# EasyEDA Pro project Car_2026-06-29.epro

# Schematic Schematic1
Board Name: Board1; Create Date: 2026-05-23; Page Name: P1; Project Name: 26电赛-校赛-两驱-1.2; Schematic Name: Schematic1; Update Date: 2026-06-12; Company: 嘉立创EDA; Page Size: A4; Version: V1.0
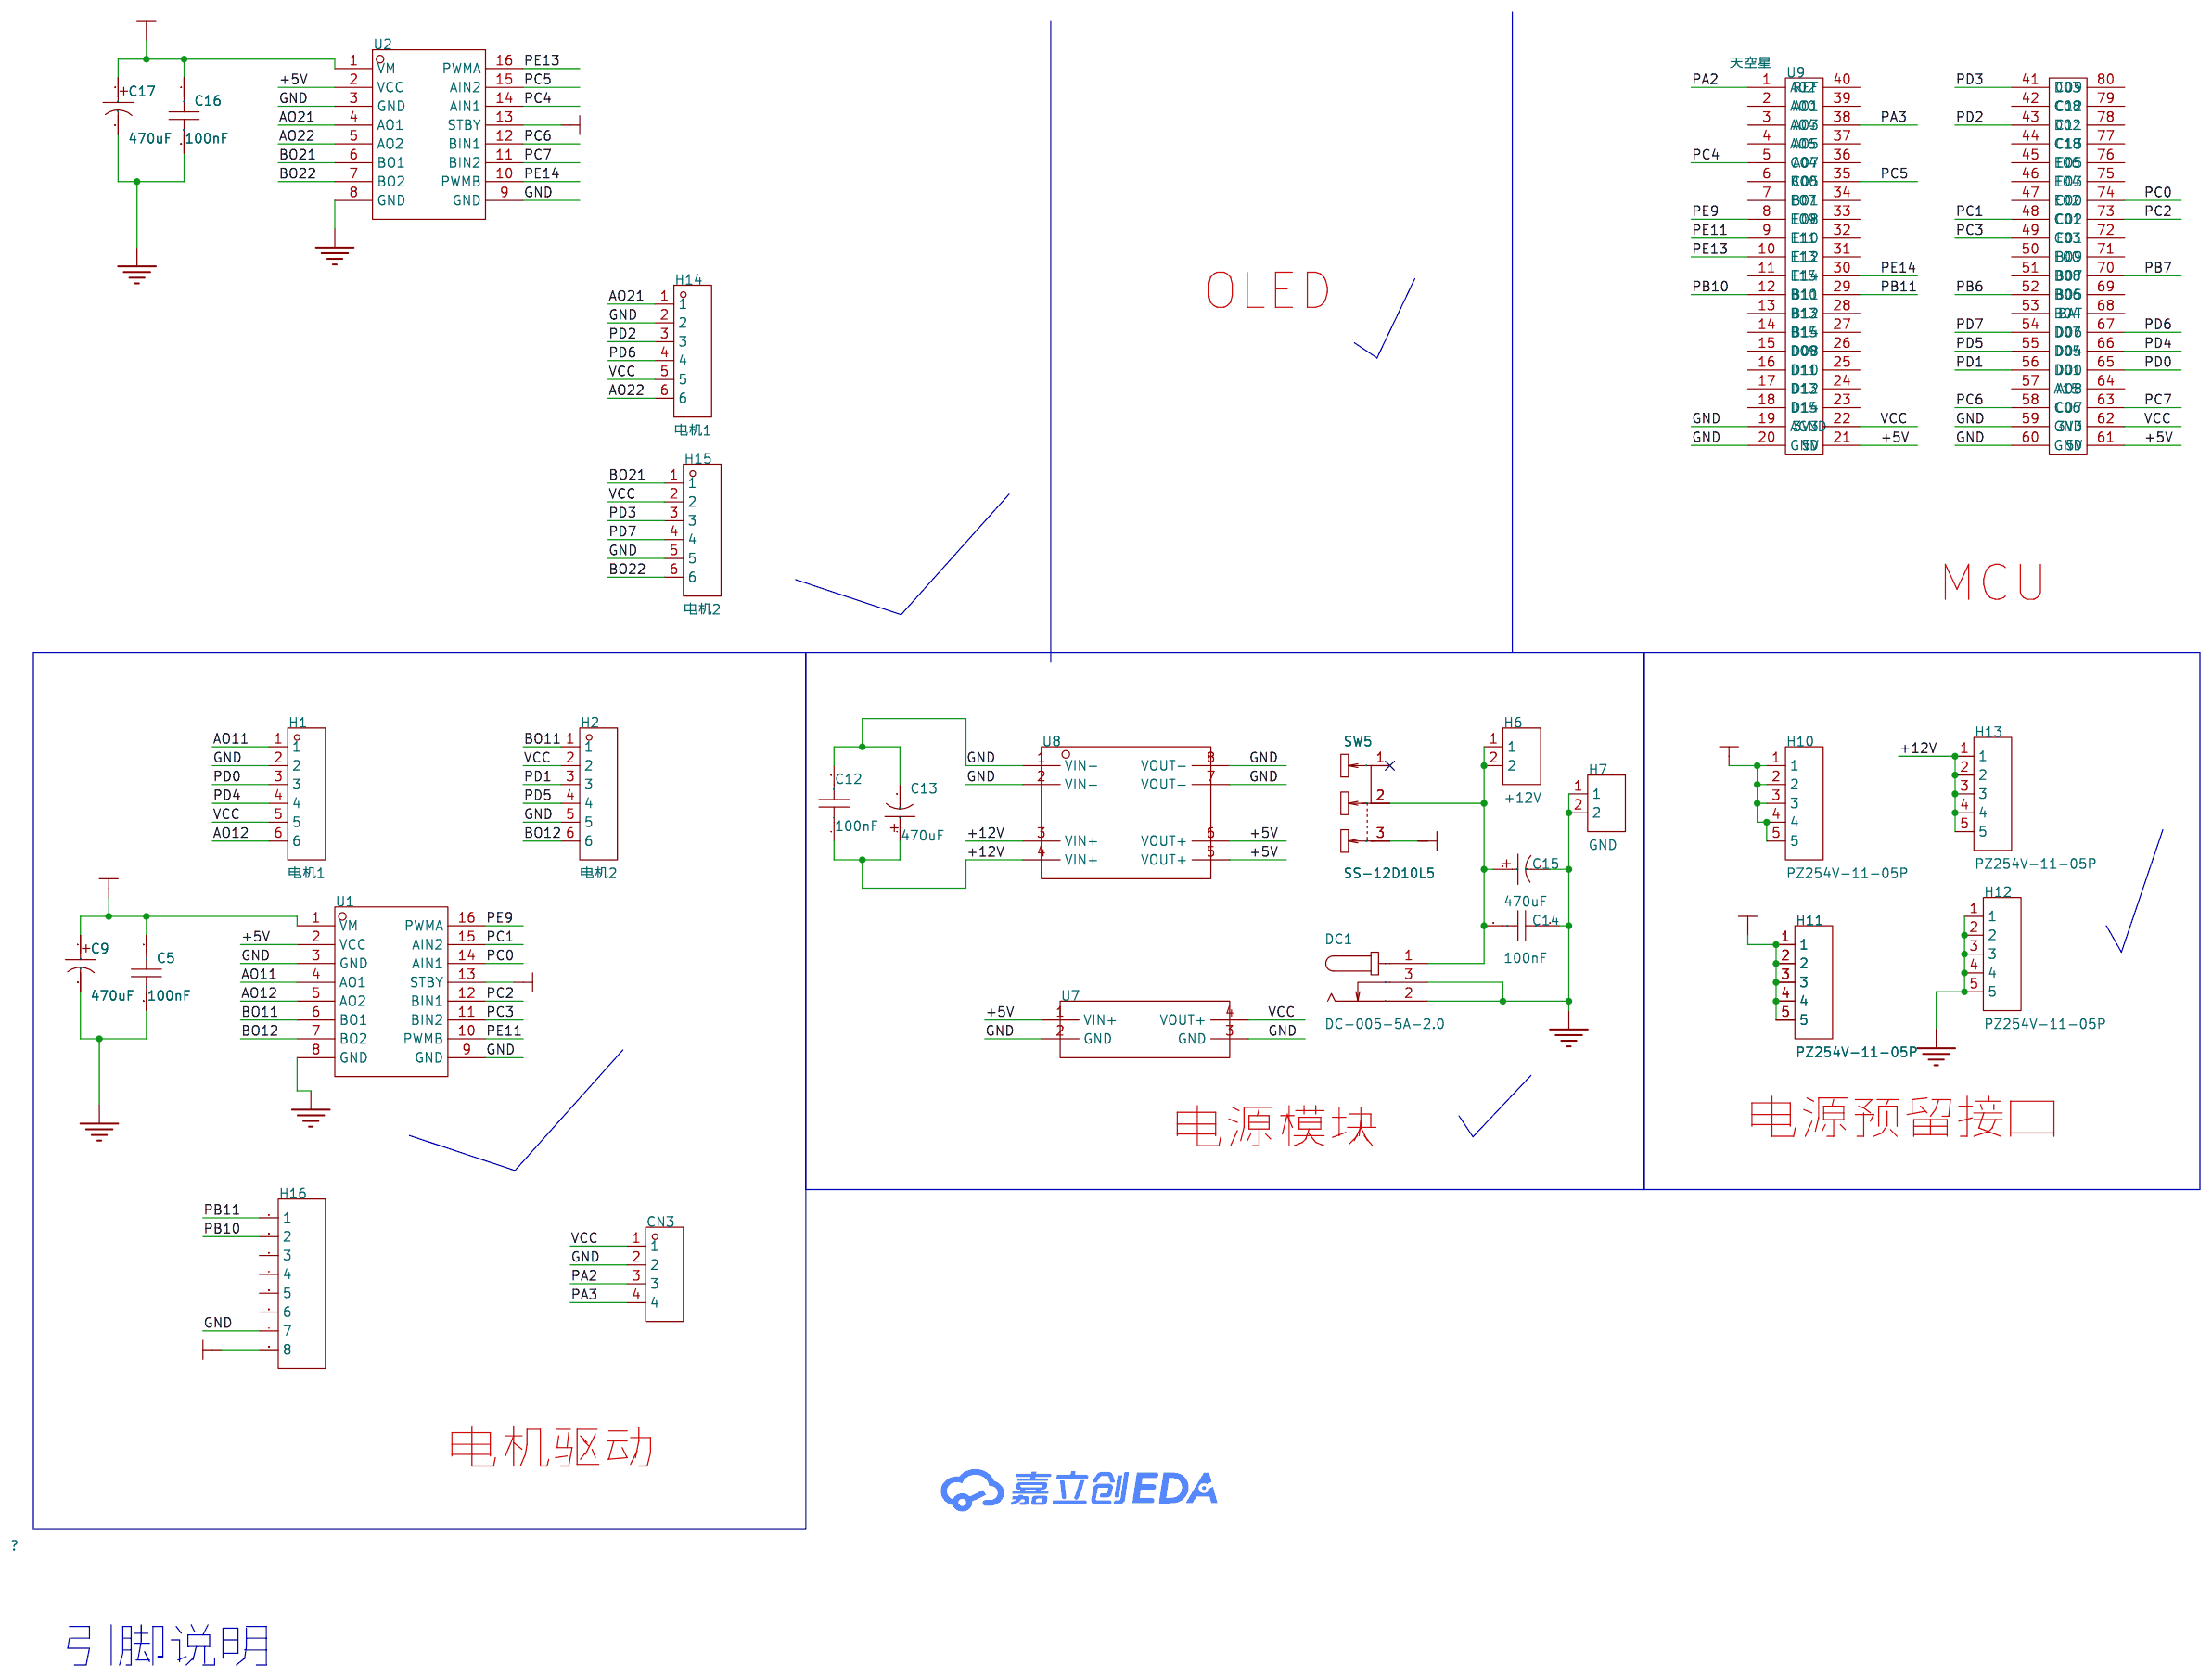
[diagram p0: schematic sheet]

## Parts
C5  100nF  [CAP-TH_L5.0-W2.5-P5.00-D1.0]
C9  470uF  [CAP-TH_BD10.0-P5.00-D1.0-FD]
C12  100nF  [CAP-TH_L5.0-W2.5-P5.00-D1.0]
C13  470uF  [CAP-TH_BD10.0-P5.00-D1.0-FD]
C14  100nF  [CAP-TH_L5.0-W2.5-P5.00-D1.0]
C15  470uF  [CAP-TH_BD10.0-P5.00-D1.0-FD]
C16  100nF  [CAP-TH_L5.0-W2.5-P5.00-D1.0]
C17  470uF  [CAP-TH_BD10.0-P5.00-D1.0-FD]
CN3  视觉  [CONN-TH_4P-P2.50_4PIN]
DC1  DC-005-5A-2.0  [DC-IN-TH_DC-005-5A-2.0]
H1  电机1  [HDR-TH_6P-P2.54-V-F]
H2  电机2  [HDR-TH_6P-P2.54-V-F]
H6  +12V  [HDR-TH_2P-P2.54-V-M]
H7  GND  [HDR-TH_2P-P2.54-V-M]
H10  PZ254V-11-05P  [HDR-TH_5P-P2.54-V-M]
H11  PZ254V-11-05P  [HDR-TH_5P-P2.54-V-M]
H12  PZ254V-11-05P  [HDR-TH_5P-P2.54-V-M]
H13  PZ254V-11-05P  [HDR-TH_5P-P2.54-V-M]
H14  电机1  [HDR-TH_6P-P2.54-V-F]
H15  电机2  [HDR-TH_6P-P2.54-V-F]
H16  -  [HDR-TH_8P-P2.54-V-M]
SW5  SS-12D10L5  [SW-TH_SS-12D10L5]
U1  TB6612  [TB6612]
U2  TB6612  [TB6612]
U7  AMS1117  [AMS1117]
U8  MP1584  [MP1584]
U9  天空星  [天空星]

## Library data of the parts
C5 C12 C14 C16 = CC1H104MC1FD3F6C10MF: 容值:100nF;精度:±20%;额定电压:50V;温度系数:Y5V;; LCSC Part Name: 100nF ±20% 50V; Supplier Part: C254085; Manufacturer: Dersonic(德尔创); Supplier Footprint: 插件,P=5.08mm; JLCPCB Part Class: 扩展库; Datasheet: https://atta.szlcsc.com/upload/public/pdf/source/20200826/C254085_159DD65BF32BF11C9168D341BCE23E6F.pdf; Supplier: LCSC; Tolerance: ±20%; Voltage Rating: 50V; Pin Spacing: 5.08mm; Temperature Coefficient: Y5V; Diameter: 6mm; Body Thickness: 2.2mm
C9 C13 C15 C17 = ERS1VM471G16OT: 容值:470uF;精度:±20%;额定电压:35V;; LCSC Part Name: 470uF ±20% 35V; Supplier Part: C106703; Manufacturer: AISHI(艾华集团); Supplier Footprint: 插件,D10xL16mm; JLCPCB Part Class: 扩展库; Datasheet: https://atta.szlcsc.com/upload/public/pdf/source/20191015/C438940_4B8E60A742BB0AE40DDEF87A5C89089D.pdf; Supplier: LCSC; Tolerance: ±20%; Voltage Rating: 35V; Pin Spacing: 5mm; Diameter: 10mm; Height - Seated (Max): 16mm; Lifetime: 7000hrs@105℃
CN3 = ZX-XH2.54-4PZZ: 插针结构:1x4P;间距:2.5mm;安装方式:直插;参考系列:XH;总PIN数:4P;排数:1;每排PIN数:4;行距:-;额定电流:3A;触头材质:黄铜;触头镀层:锡;工作温度范围:-25℃~+85℃;; LCSC Part Name: 1x4P 间距:2.5mm 直插 系列:XH; Supplier Part: C7429634; Manufacturer: Megastar(兆星); Supplier Footprint: 插件,P=2.5mm; JLCPCB Part Class: 扩展库; Datasheet: https://atta.szlcsc.com/upload/public/pdf/source/20230619/B529A2163E0159A644AB3383D208FB03.pdf; Supplier: LCSC; Pins Structure: 1x4P; Pitch: 2.5mm; Mounting Type: 直插; Reference Series: XH; Number of Pins: 4P; Number of Rows: 1; Number of PINs Per Row: 4; Rated Current: 3A; Contact Material: 黄铜; Contact Plating: 锡; Operating Temperature: -25℃~+85℃; Rated Voltage (Max): 250V; Plastic Material: PA66; Flame Retardant Rating: UL94V-0; Color: 白色; Z-Height of the Board: 7mm; X-Length of Bottom Edge on Board (Spacing Line): 12.5mm; Y-Width of Bottom Edge on Board: 5.9mm
DC1 = DC-005-5A-2.0: 连接器类型:DC电源插座;安装方式:弯插;触点内径:2mm;触点外径:6.2mm;额定电流:5A;额定电压:24V;工作温度范围:-20℃~+70℃;; LCSC Part Name: DC电源插座 内径:2mm 外径:6.2mm; Supplier Part: C381116; Manufacturer: XKB Connection(中国星坤); Supplier Footprint: 插件; JLCPCB Part Class: 扩展库; Datasheet: https://atta.szlcsc.com/upload/public/pdf/source/20211015/707A35F7AB6E89C57AAB641950105BB7.pdf; Supplier: LCSC; Connector Type: DC电源插座; Mounting Style: 弯插; Inside Contact Diameter: 2mm; Outside Contact Diameter: 6.2mm; Current Rating (Max): 5A; Voltage Rating (Max): 24V; Operating Temperature Range: -20℃~+70℃
H1 H2 H14 H15 = PM254V-11-06-H85: 插孔结构:1x6P;间距:2.54mm;行距:-;圆孔/方孔:方孔;安装类型:直插;排数:单排;总孔位数:6P;额定电流:3A;额定电压:250V;插孔方向:顶部;塑高:-;工作温度范围:-40℃~+105℃;; LCSC Part Name: 间距:2.54mm 1x6P 直插; Supplier Part: C2832269; Manufacturer: XFCN(兴飞); Supplier Footprint: 插件,P=2.54mm; JLCPCB Part Class: 扩展库; Datasheet: https://atta.szlcsc.com/upload/public/pdf/source/20210514/C2832269_B3EC97736B37C2783BDCE3050AA57447.pdf; Supplier: LCSC; Holes Structure: 1x6P; Pitch: 2.54mm; Circular Hole / Square Hole: 方孔; Mounting Type: 直插; Number of Rows: 单排; Number of Holes: 6P; Current Rating (Max): 3A; Voltage Rating (Max): 250V; Holes Direction: 顶部; Operating Temperature Range: -40℃~+105℃
H6 H7 = PZ254V-11-02P: 插针结构:1x2P;间距:2.54mm;行距:-;圆针/方针:方针;安装方式:直插;排数:单排;总PIN位数:2P;额定电流:-;额定电压:-;配合针长度:6mm;塑高:2.5mm;端接针长度:3mm;触头材质:黄铜;触头镀层:-;工作温度:-40℃~+105℃;颜色:黑色;; LCSC Part Name: 1x2P 间距:2.54mm 方针 直插; Supplier Part: C492401; Manufacturer: XFCN(兴飞); Supplier Footprint: 插件,P=2.54mm; JLCPCB Part Class: 扩展库; Datasheet: https://item.szlcsc.com/datasheet/PZ254V-11-02P/502957.html; Supplier: LCSC; Pin Structure: 1x2P; Pitch: 2.54mm; Circluar Pins/Square Pins: 方针; Mounting Type: 直插; Number of Rows: 单排; Number of Pins: 2P; Length of Mating Pin: 6mm; Insulation Height: 2.5mm; Length of End Connection Pin: 3mm; Contact Material: 黄铜; Operating Temperature: -40℃~+105℃; Color: 黑色
H10-H13 = PZ254V-11-05P: 插针结构:1x5P;间距:2.54mm;行距:-;圆针/方针:方针;安装方式:直插;排数:单排;总PIN位数:5P;额定电流:3A;额定电压:250V;配合针长度:6mm;塑高:2.5mm;端接针长度:3mm;触头材质:黄铜;触头镀层:-;工作温度:-40℃~+105℃;颜色:黑色;; LCSC Part Name: 1x5P 间距:2.54mm 方针 直插; Supplier Part: C492404; Manufacturer: XFCN(兴飞); Supplier Footprint: 插件,P=2.54mm; JLCPCB Part Class: 扩展库; Datasheet: https://item.szlcsc.com/datasheet/PZ254V-11-05P/502960.html; Supplier: LCSC; Pin Structure: 1x5P; Pitch: 2.54mm; Circluar Pins/Square Pins: 方针; Mounting Type: 直插; Number of Rows: 单排; Number of Pins: 5P; Current Rating: 3A; Voltage Rating (Max): 250V; Length of Mating Pin: 6mm; Insulation Height: 2.5mm; Length of End Connection Pin: 3mm; Contact Material: 黄铜; Operating Temperature: -40℃~+105℃; Color: 黑色
H16 = HDR-M_2.54_1x8P: Supplier Part: C124381; Supplier Footprint: 插件
SW5 = SS-12D10L5: 电路结构:单刀双掷;安装方式:直插;开关颜色:黑色;额定电流(DC):3A;额定电压(DC):125V;额定电流(AC):3A;额定电压(AC):125V;机械寿命:1万次;; LCSC Part Name: 柄长5mm 直插双档 滑动开关; Supplier Part: C319012; Manufacturer: XKB Connectivity(中国星坤); Supplier Footprint: 插件; JLCPCB Part Class: 扩展库; Datasheet: https://atta.szlcsc.com/upload/public/pdf/source/20211009/D6412F37AABE6F9459A6EE7FA4DAEADB.pdf; Supplier: LCSC; Circuit: 单刀双掷; Actuator Style: 矩形柱状; Pin Style: PC引脚; Switch Length: 13mm; Switch Width: 6.8mm; Switch Height: 6.4mm; Mounting Style: 直插; Actuator Color: 黑色; Current Rating (DC): 3A; Voltage Rating (DC): 125V; Current Rating (AC): 3A; Voltage Rating (AC): 125V; Mechanical Life: 1万次; Operating Temperature: -40℃~+85℃
U1 U2 = TB6612: 市场上的TB6612模块，红色那款
U7 = AMS1117: AMS1117稳压管，5V转3.3V
U8 = MP1584: MP1584EN DC-DC可调降压模块，绿色小板
U9 = 天空星

## Nets
+5V: H11.1 H11.2 H11.3 H11.4 H11.5 U1.2(VCC) U1.13(STBY) U2.2(VCC) U2.13(STBY) U7.1(VIN+) U8.5(VOUT+) U8.6(VOUT+) U9.21(5V) U9.61(5V)
+12V: C5.1 C9.1 C12.1 C13.1 C16.1 C17.1 H13.1 H13.2 H13.3 H13.4 H13.5 H16.8 SW5.3 U1.1(VM) U2.1(VM) U8.3(VIN+) U8.4(VIN+)
GND: C5.2 C9.2 C12.2 C13.2 C14.1 C15.2 C16.2 C17.2 CN3.2 DC1.2 DC1.3 H1.2 H2.5 H7.1 H7.2 H12.1 H12.2 H12.3 H12.4 H12.5 H14.2 H15.5 H16.7 U1.3(GND) U1.8(GND) U1.9(GND) U2.3(GND) U2.8(GND) U2.9(GND) U7.2(GND) U7.3(GND) U8.1(VIN-) U8.2(VIN-) U8.7(VOUT-) U8.8(VOUT-) U9.19(AGND) U9.20(GND) U9.59(GND) U9.60(GND)
VCC: CN3.1 H1.5 H2.2 H10.1 H10.2 H10.3 H10.4 H10.5 H14.5 H15.2 U7.4(VOUT+) U9.22(3V3) U9.62(3V3)
AO11: H1.1 U1.4(AO1)
AO12: H1.6 U1.5(AO2)
AO21: H14.1 U2.4(AO1)
AO22: H14.6 U2.5(AO2)
BO11: H2.1 U1.6(BO1)
BO12: H2.6 U1.7(BO2)
BO21: H15.1 U2.6(BO1)
BO22: H15.6 U2.7(BO2)
PA2: CN3.3 U9.1(A02)
PA3: CN3.4 U9.38(A03)
PB6: U9.52(B06)
PB7: U9.70(B07)
PB10: H16.2 U9.12(B10)
PB11: H16.1 U9.29(B11)
PC0: U1.14(AIN1) U9.74(C00)
PC1: U1.15(AIN2) U9.48(C01)
PC2: U1.12(BIN1) U9.73(C02)
PC3: U1.11(BIN2) U9.49(C03)
PC4: U2.14(AIN1) U9.5(C04)
PC5: U2.15(AIN2) U9.35(C05)
PC6: U2.12(BIN1) U9.58(C06)
PC7: U2.11(BIN2) U9.63(C07)
PD0: H1.3 U9.65(D00)
PD1: H2.3 U9.56(D01)
PD2: H14.3 U9.43(D02)
PD3: H15.3 U9.41(D03)
PD4: H1.4 U9.66(D04)
PD5: H2.4 U9.55(D05)
PD6: H14.4 U9.67(D06)
PD7: H15.4 U9.54(D07)
PE9: U1.16(PWMA) U9.8(E09)
PE11: U1.10(PWMB) U9.9(E11)
PE13: U2.16(PWMA) U9.10(E13)
PE14: U2.10(PWMB) U9.30(E14)
$1N2072: C14.2 C15.1 DC1.1 H6.1 H6.2 SW5.2

Not connected (* = marked no-connect by the designer): H16 3 4 5 6; SW5 1*; U9 2(A00) 3(A04) 4(A06) 6(B00) 7(E07) 11(E15) 13(B13) 14(B15) 15(D09) 16(D11) 17(D13) 18(D15) 23(D14) 24(D12) 25(D10) 26(D08) 27(B14) 28(B12) 31(E12) 32(E10) 33(E08) 34(B01) 36(A07) 37(A05) 39(A01) 40(REF) 42(C08) 44(C18) 45(E06) 46(E04) 47(E02) 50(E00) 51(B08) 53(B04) 57(A15) 64(A08) 68(BAT) 69(B05) 71(B09) 72(E01) 75(E03) 76(E05) 77(C13) 78(C11) 79(C12) 80(C09)

## Notes on the sheet
- OLED
- MCU
- 电源模块
- 电源预留接口
- 电机驱动
- 引脚说明

# Board PCB1
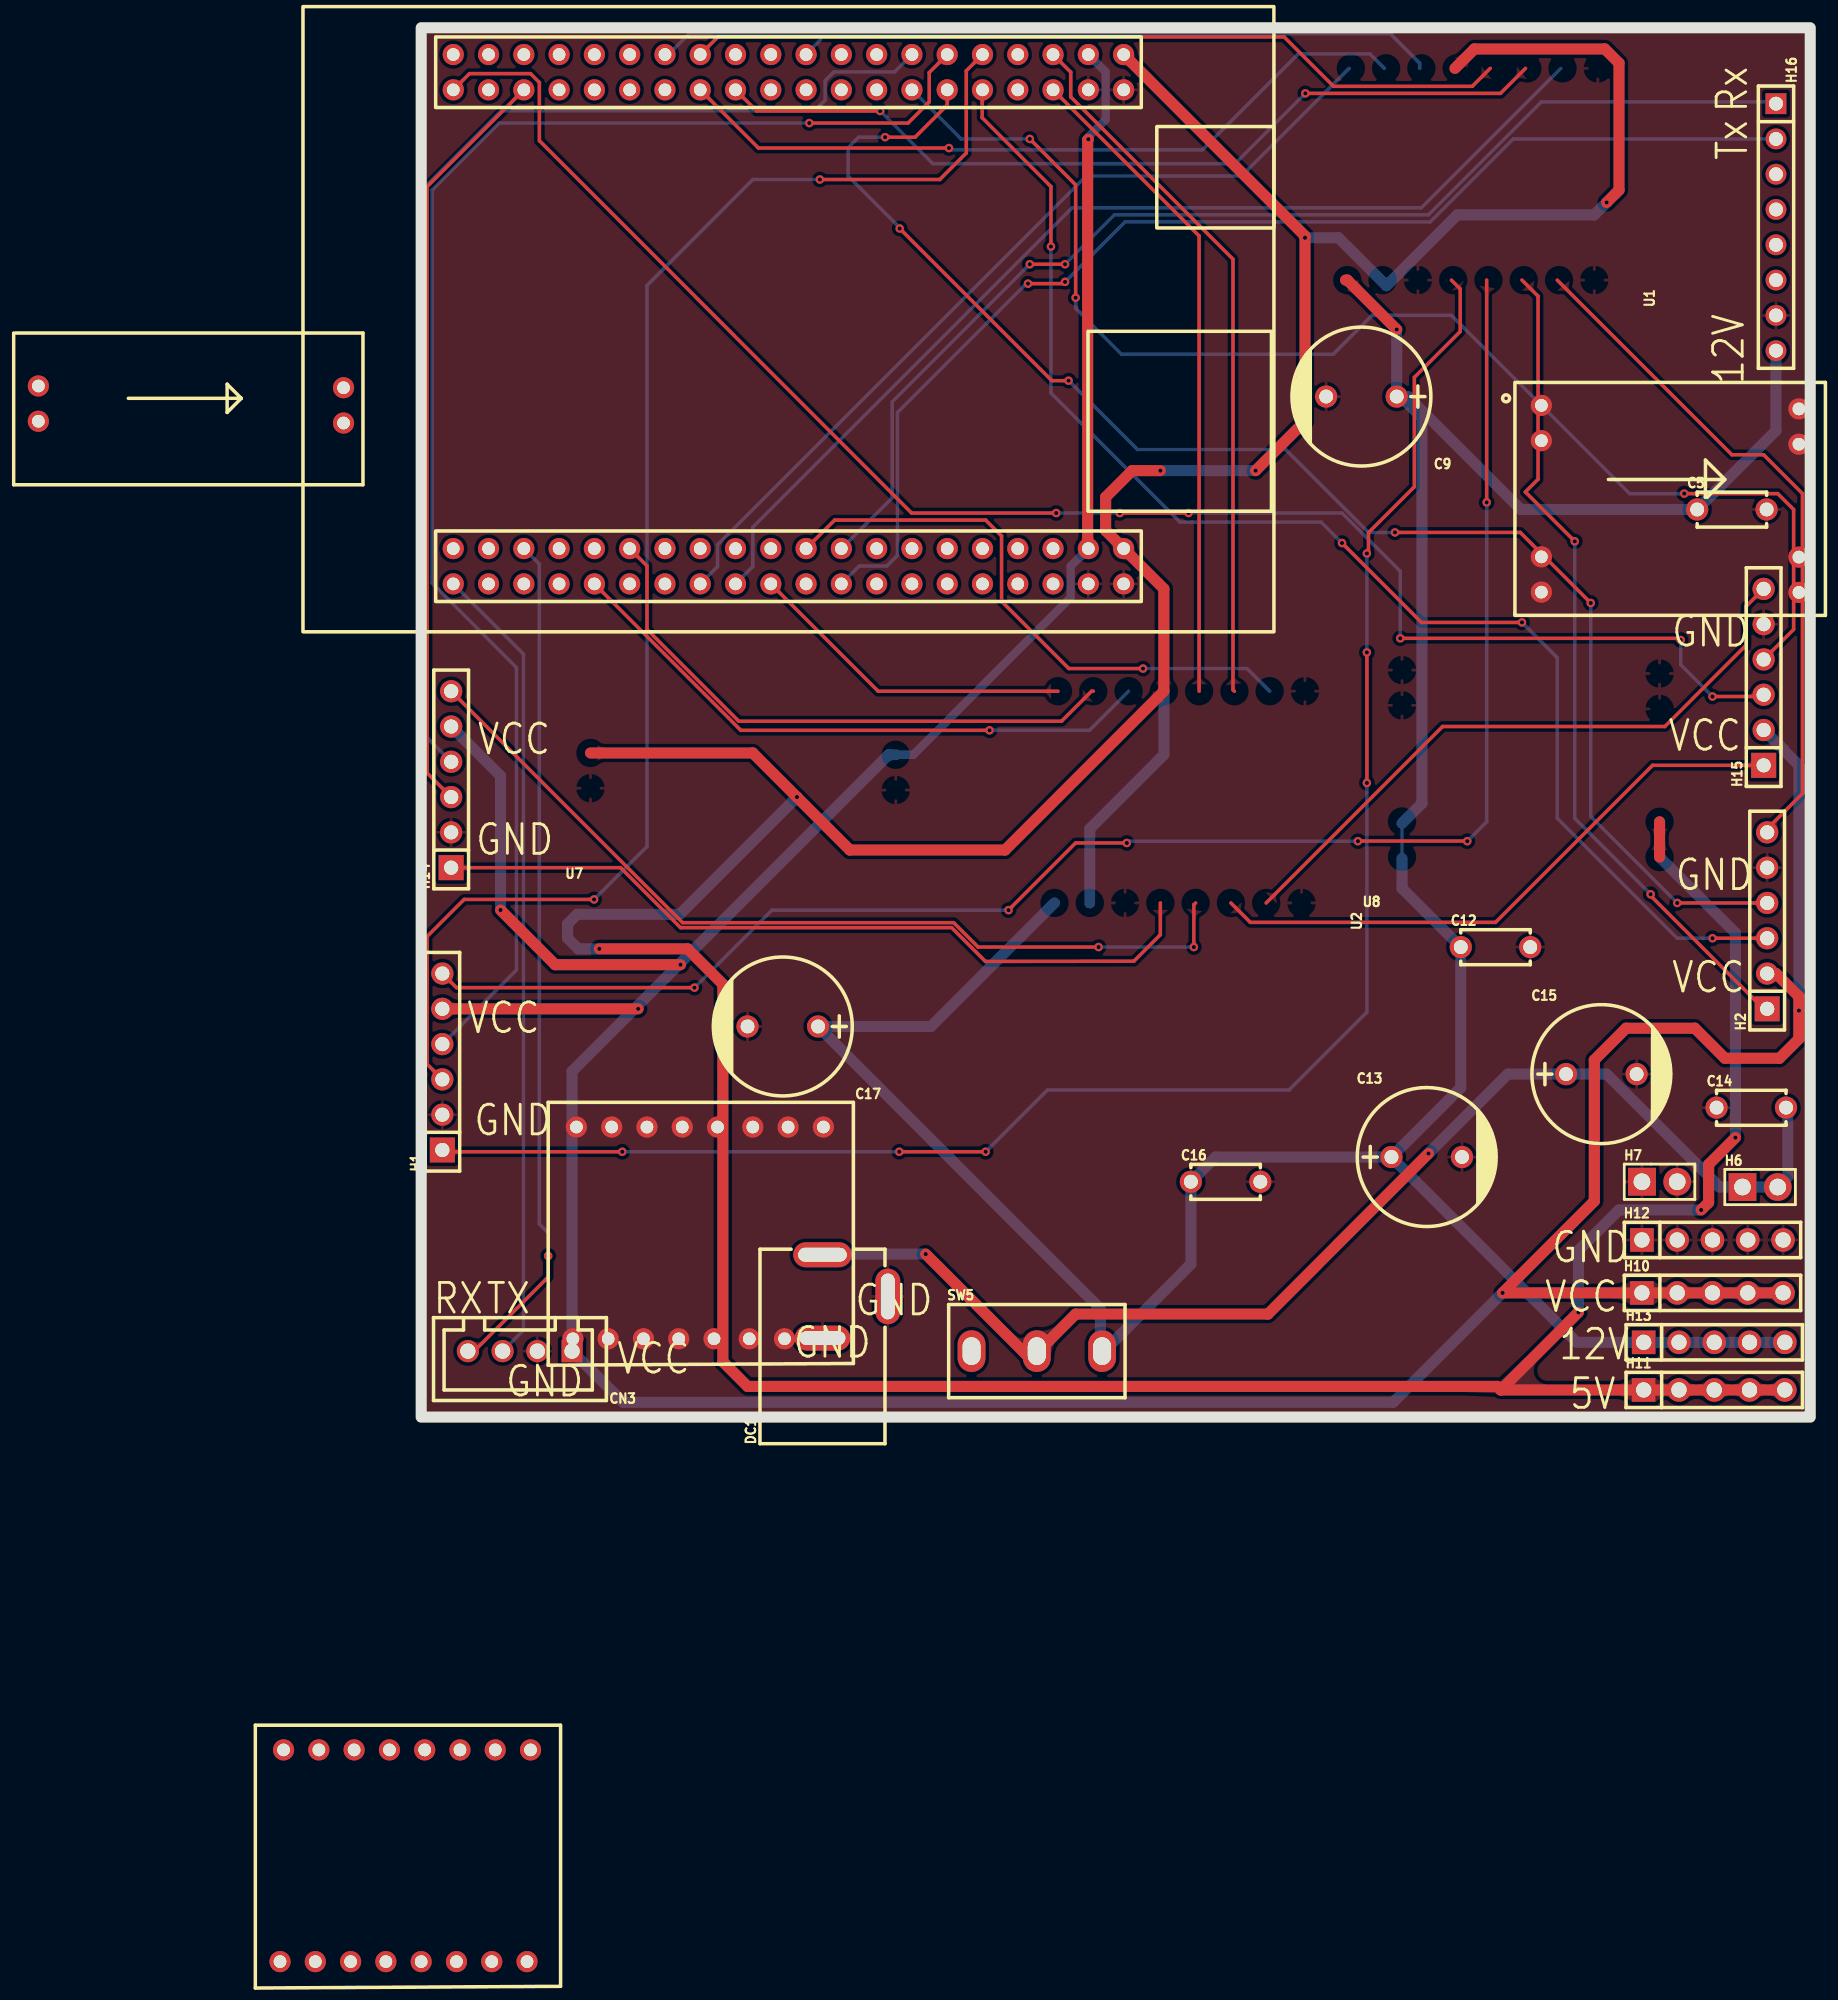
[diagram p1: board, top side]
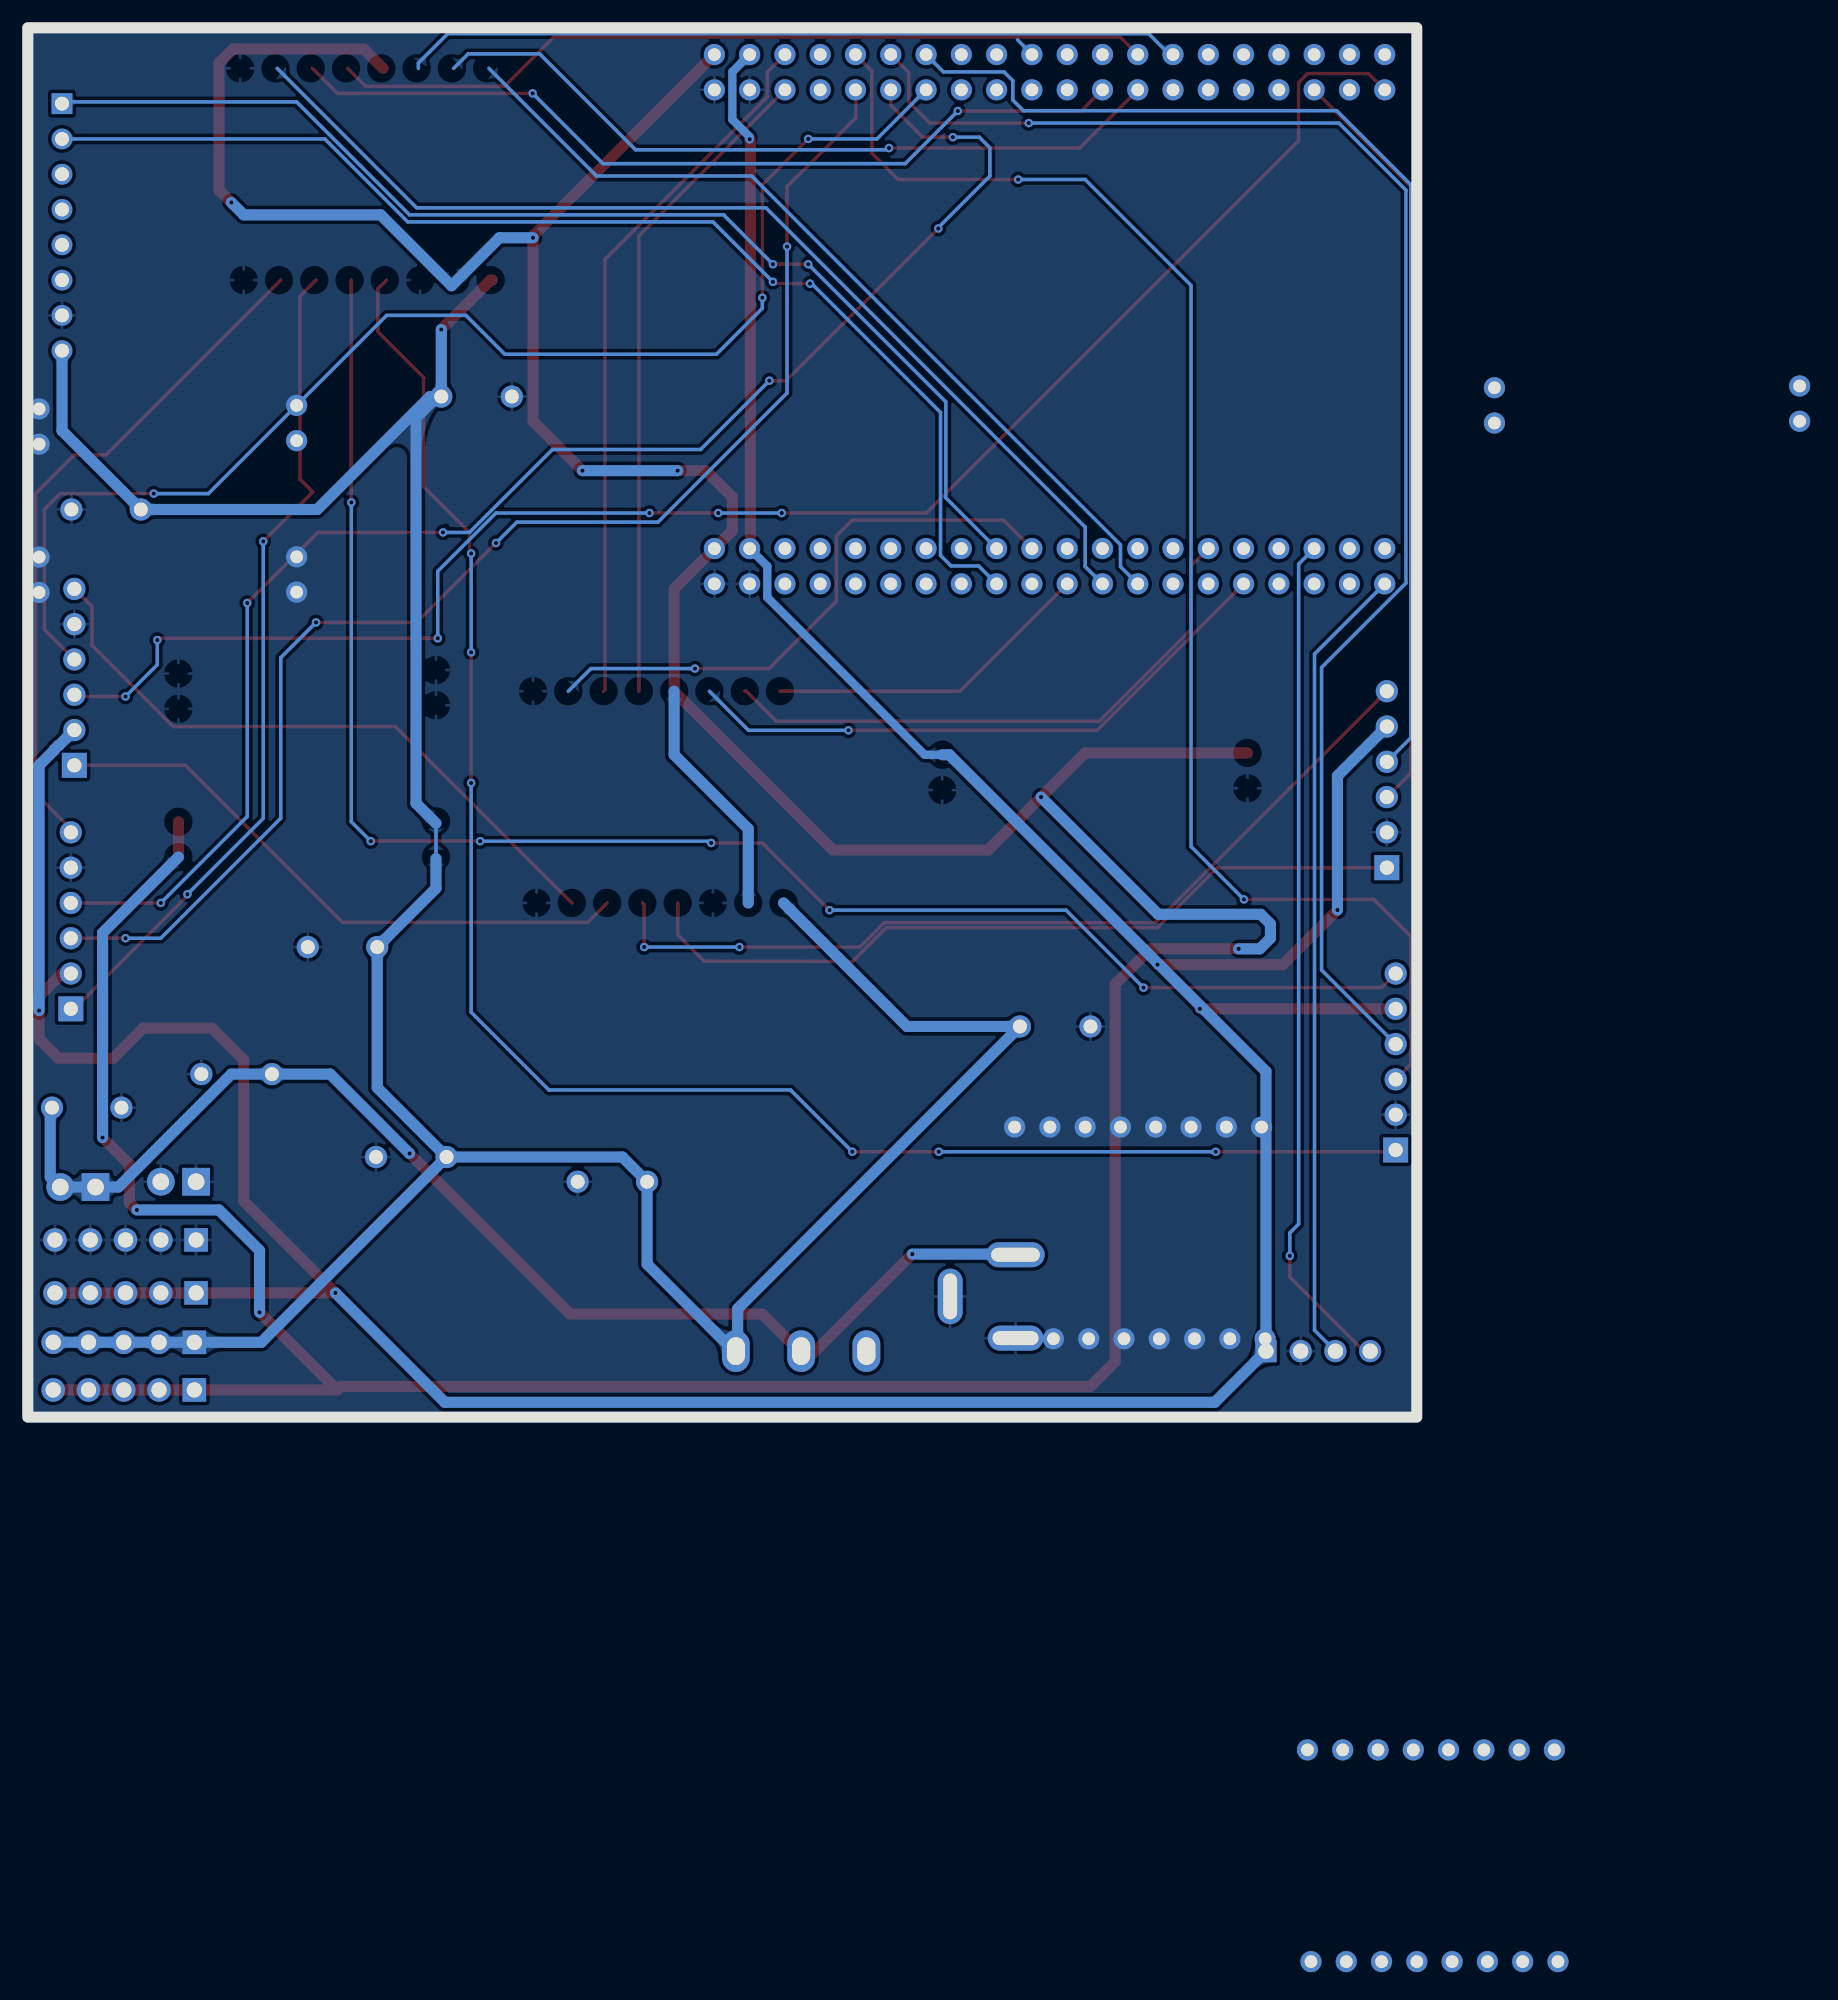
[diagram p2: board, bottom side, seen from below]

Outline 100 x 100 mm; copper layers: Top Layer, Bottom Layer. Coordinates in mm from the lower left corner of the outline.
Outline path: rectangle 0,100 100,0
Stack: Top Layer 0.035mm / Dielectric1 1.51mm FR4 er 4.5 / Bottom Layer 0.035mm

## Design rules (mm)
template: JLCPCB Capability(Two Layers Board)
spacing copperThickness1oz (default): track to track 0.102, other pairs 0.152 to 0.3
spacing copperThickness2oz: track to track 0.203, other pairs 0.152 to 0.3
track width copperThickness1oz (default): min 0.127, default 0.254, max 2.54
track width copperThickness2oz: min 0.203, default 0.254, max 2.54
differential pair differentialPair (default): width min 0.127, default 0.254, max 2.54; gap min 0.152, default 0.152
via viaSize (default): diameter min 0.5, default 0.61, max 10; hole min 0.3, default 0.305, max 6.3

## Placement (name value [footprint] x y rotation side)
C5  100nF  [CAP-TH_L5.0-W2.5-P5.00-D1.0]  94.36 65.33 0 top
C9  470uF  [CAP-TH_BD10.0-P5.00-D1.0-FD]  67.69 73.46 180 top
C12  100nF  [CAP-TH_L5.0-W2.5-P5.00-D1.0]  77.34 33.83 0 top
C13  470uF  [CAP-TH_BD10.0-P5.00-D1.0-FD]  72.39 18.72 0 top
C14  100nF  [CAP-TH_L5.0-W2.5-P5.00-D1.0]  95.76 22.28 0 top
C15  470uF  [CAP-TH_BD10.0-P5.00-D1.0-FD]  84.96 24.69 0 top
C16  100nF  [CAP-TH_L5.0-W2.5-P5.00-D1.0]  57.91 16.94 0 top
C17  470uF  [CAP-TH_BD10.0-P5.00-D1.0-FD]  26.03 28.12 180 top
CN3  视觉  [CONN-TH_4P-P2.50_4PIN]  7.11 4.75 180 top
DC1  DC-005-5A-2.0  [DC-IN-TH_DC-005-5A-2.0]  31.24 8.69 90 top
H1  电机1  [HDR-TH_6P-P2.54-V-F]  1.52 25.58 90 top
H2  电机2  [HDR-TH_6P-P2.54-V-F]  96.9 35.74 90 top
H6  +12V  [HDR-TH_2P-P2.54-V-M]  96.39 16.56 0 top
H7  GND  [HDR-TH_2P-P2.54-V-M]  89.15 16.94 0 top
H10  PZ254V-11-05P  [HDR-TH_5P-P2.54-V-M]  92.96 8.94 0 top
H11  PZ254V-11-05P  [HDR-TH_5P-P2.54-V-M]  93.09 1.96 0 top
H12  PZ254V-11-05P  [HDR-TH_5P-P2.54-V-M]  92.96 12.75 0 top
H13  PZ254V-11-05P  [HDR-TH_5P-P2.54-V-M]  93.09 5.38 0 top
H14  电机1  [HDR-TH_6P-P2.54-V-F]  2.16 45.9 90 top
H15  电机2  [HDR-TH_6P-P2.54-V-F]  96.65 53.26 90 top
H16  -  [HDR-TH_8P-P2.54-V-M]  97.54 85.65 270 top
SW5  SS-12D10L5  [SW-TH_SS-12D10L5]  44.32 4.75 0 top
U1  -  [TB6612]  66.68 81.84 90 top
U2  -  [TB6612]  45.59 37.01 90 top
U7  -  [AMS1117]  12.19 47.8 0 top
U8  -  [MP1584]  70.61 53.77 0 top
U9  -  [天空星]  -8.51 101.52 0 top

## Footprints (pads in the part's own frame, mm; a bottom-side part is the same pattern mirrored in y, then rotated)
AMS1117
  round 1.524 hole 0.914: 1(-39.751,26.416) 2(-39.751,23.876) 3(-17.78,23.749) 4(-17.78,26.289)
CAP-TH_BD10.0-P5.00-D1.0-FD
  round 1.6 hole 1: 1(-2.54,0) 2(2.54,0)
CAP-TH_L5.0-W2.5-P5.00-D1.0
  round 1.6 hole 1: 1(-2.5,0) 2(2.5,0)
CONN-TH_4P-P2.50_4PIN
  rect 1.524x1.6 hole 1.1: 1(-3.75,0)
  round 1.6 hole 1.1: 2(-1.25,0) 3(1.25,0) 4(3.75,0)
DC-IN-TH_DC-005-5A-2.0
  oval 1.8x4.2 hole 1x3.5: 1(3,2.352)
  oval 1.8x4 hole 1x3.3: 2(-3,2.352)
  oval 4x1.8 hole 3.3x1: 3(-0.001,-2.352)
HDR-TH_2P-P2.54-V-M
  rect 2x2 hole 1.2: 1(-1.27,0)
  round 2 hole 1.2: 2(1.27,0)
HDR-TH_5P-P2.54-V-M
  rect 1.7x1.7 hole 1.1: 1(-5.08,0)
  round 1.7 hole 1.1: 2(-2.54,0) 3(0,0) 4(2.54,0) 5(5.08,0)
HDR-TH_6P-P2.54-V-F
  rect 1.8x1.8 hole 1.02: 1(-6.35,0)
  round 1.6 hole 1.02: 2(-3.81,0) 3(-1.27,0) 4(1.27,0) 5(3.81,0) 6(6.35,0)
HDR-TH_8P-P2.54-V-M
  rect 1.5x1.5 hole 1: 1(-8.89,0)
  round 1.5 hole 1: 2(-6.35,0) 3(-3.81,0) 4(-1.27,0) 5(1.27,0) 6(3.81,0) 7(6.35,0) 8(8.89,0)
MP1584
  round 1.524 hole 0.914: 1(10.033,19.05) 2(10.033,16.51) 3(10.033,8.149) 4(10.033,5.609) 5(28.575,5.588) 6(28.575,8.128) 7(28.575,16.256) 8(28.575,18.796)
SW-TH_SS-12D10L5
  oval 2x3 hole 1.3x2: 1(-4.7,0) 2(0,0) 3(4.7,0)
TB6612
  round 1.524 hole 0.914: 1(-76.2,55.753) 2(-76.2,53.213) 3(-76.2,50.673) 4(-76.2,48.133) 5(-76.2,45.593) 6(-76.2,43.053) 7(-76.2,40.513) 8(-76.2,37.973) 9(-60.96,37.719) 10(-60.96,40.259) 11(-60.96,42.799) 12(-60.96,45.339) 13(-60.96,47.879) 14(-60.96,50.419) 15(-60.96,52.959) 16(-60.96,55.499)
天空星
  round 1.524 hole 0.914: 1(10.82,-41.55) 2(13.36,-41.55) 3(15.9,-41.55) 4(18.44,-41.55) 5(20.98,-41.55) 6(23.52,-41.55) 7(26.06,-41.55) 8(28.6,-41.55) 9(31.14,-41.55) 10(33.68,-41.55) 11(36.22,-41.55) 12(38.76,-41.55) 13(41.3,-41.55) 14(43.84,-41.55) 15(46.38,-41.55) 16(48.92,-41.55) 17(51.46,-41.55) 18(54,-41.55) 19(56.54,-41.55) 20(59.08,-41.55) 21(59.08,-39.01) 22(56.54,-39.01) 23(54,-39.01) 24(51.46,-39.01) 25(48.92,-39.01) 26(46.38,-39.01) 27(43.84,-39.01) 28(41.3,-39.01) 29(38.76,-39.01) 30(36.22,-39.01) 31(33.68,-39.01) 32(31.14,-39.01) 33(28.6,-39.01) 34(26.06,-39.01) 35(23.52,-39.01) 36(20.98,-39.01) 37(18.44,-39.01) 38(15.9,-39.01) 39(13.36,-39.01) 40(10.82,-39.01) 41(10.82,-5.99) 42(13.36,-5.99) 43(15.9,-5.99) 44(18.44,-5.99) 45(20.98,-5.99) 46(23.52,-5.99) 47(26.06,-5.99) 48(28.6,-5.99) 49(31.14,-5.99) 50(33.68,-5.99) 51(36.22,-5.99) 52(38.76,-5.99) 53(41.3,-5.99) 54(43.84,-5.99) 55(46.38,-5.99) 56(48.92,-5.99) 57(51.46,-5.99) 58(54,-5.99) 59(56.54,-5.99) 60(59.08,-5.99) 61(59.08,-3.45) 62(56.54,-3.45) 63(54,-3.45) 64(51.46,-3.45) 65(48.92,-3.45) 66(46.38,-3.45) 67(43.84,-3.45) 68(41.3,-3.45) 69(38.76,-3.45) 70(36.22,-3.45) 71(33.68,-3.45) 72(31.14,-3.45) 73(28.6,-3.45) 74(26.06,-3.45) 75(23.52,-3.45) 76(20.98,-3.45) 77(18.44,-3.45) 78(15.9,-3.45) 79(13.36,-3.45) 80(10.82,-3.45)

## Nets
As in the schematic.

Pads without a net: H16 3 4 5 6; SW5 1; U9 2 3 4 6 7 11 13 14 15 16 17 18 23 24 25 26 27 28 31 32 33 34 36 37 39 40 42 44 45 46 47 50 51 53 57 64 68 69 71 72 75 76 77 78 79 80

## Via types
v1: diameter 0.61, hole 0.305, Top Layer to Bottom Layer, 66 vias

## Routing (per net, layer and track width the routed paths; a pad name or vN(x,y) marks a point on that pad's centre or on a via; arc(x,y) is an arc through that point)
+5V: length 371.3
  Top Layer w0.8: 77.72,1.96 H11.1 H11.2 H11.3 H11.4 H11.5 ; 77.72,1.96 v1(83.31,7.54) ; 77.72,1.96 77.47,2.21 23.5,2.21 21.72,3.99 21.72,31.17 19.18,33.71 v1(12.83,33.71) ; v1(85.34,87.43) 86.23,88.32 86.23,97.46 85.22,98.48 75.82,98.48 74.42,97.08 ; 12.19,47.8 23.88,47.8 v1(27.05,44.63) 30.86,40.82 42.04,40.82 53.47,52.25 53.47,59.62 U9.21 49.28,63.81 49.28,66.22 51.18,68.12 v1(53.21,68.12) ; 89.15,40.31 89.15,42.85 ; v1(92.15,14.91) 92.69,15.45 92.69,18.19 v1(94.62,20.12) ; U9.61 63.63,85.02 v1(63.63,84.89) 63.63,71.68 v1(60.07,68.12)
  Bottom Layer w0.8: v1(92.15,14.91) 86.23,14.91 83.31,11.99 v1(83.31,7.54) ; v1(85.34,87.43) 84.46,86.54 74.6,86.54 69.49,81.43 66.04,84.89 v1(63.63,84.89) ; v1(12.83,33.71) 11.3,33.71 10.54,34.47 10.54,35.49 11.24,36.19 18.61,36.19 v1(27.05,44.63) ; v1(60.07,68.12) v1(53.21,68.12) ; 89.15,40.31 94.62,34.85 v1(94.62,20.12) ; 48.13,37.01 48.13,42.34 53.47,47.68 53.47,52.25
+12V: length 225.4
  Top Layer w0.8: 66.55,81.84 66.68,81.84 v1(70.23,78.28)
  Bottom Layer w0.254: 70.53,73.46 C9.1 ; 70.61,42.74 70.61,40.2
  Bottom Layer w0.8: C13.1 74.84,23.71 C12.1 70.61,38.06 70.61,40.2 ; C13.1 83.19,5.38 H13.1 H13.2 H13.3 H13.4 H13.5 ; C13.1 57.19,18.72 C16.1 55.41,11.01 48.9,4.5 48.9,7.8 C17.1 36.7,28.12 45.59,37.01 ; H16.8 97.54,71 C5.1 79.16,65.33 71.03,73.46 70.53,73.46 72.05,71.93 72.05,44.18 70.61,42.74 ; C9.1 v1(70.23,78.28)
VCC: length 310.5
  Top Layer w0.8: v1(18.67,32.56) 9.65,32.56 v1(5.72,36.5) ; 96.52,31.93 97.54,31.93 99.19,30.28 v1(99.19,29.26) 99.19,27.23 97.79,25.83 93.85,25.83 91.69,27.99 86.74,27.99 84.46,25.71 84.46,15.54 v1(77.85,8.94) H10.1 H10.2 H10.3 H10.4 H10.5 ; H1.5 v1(15.62,29.39) ; U9.22 47.98,62.56 47.98,91.93 v1(48.03,91.98)
  Bottom Layer w0.6: 34.16,47.68 35.43,47.68 46.76,59 46.76,61.24 U9.22 ; v1(48.03,91.98) 48.03,92.15 49.28,93.4 49.28,96.83 U9.62
  Bottom Layer w0.8: v1(77.85,8.94) 69.98,1.07 14.55,1.07 CN3.1 10.86,24.88 33.66,47.68 34.16,47.68 ; v1(5.72,36.5) 5.72,46.15 H14.5 ; H15.2 97.74,48.37 97.78,48.37 98.1,48.04 98.1,48 99.19,46.91 v1(99.19,29.26)
AO11: length 126.5
  Top Layer w0.254: v1(14.48,19.1) 1.65,19.1 H1.1 ; 74.17,81.84 74.8,81.2 74.8,78.14 71.5,74.84 71.5,66.96 68.2,63.66 68.2,62.28 v1(68.08,62.16) ; v1(40.64,19.1) v1(34.42,19.1) ; v1(68.08,55.04) v1(68.08,45.64)
  Bottom Layer w0.254: v1(40.64,19.1) 45.09,23.55 62.48,23.55 68.08,29.14 v1(68.08,45.64) ; v1(68.08,62.16) v1(68.08,55.04) ; v1(34.42,19.1) v1(14.48,19.1)
AO12: length 119.5
  Top Layer w0.254: v1(19.68,30.91) 2.54,30.91 H1.6 ; v1(50.8,41.33) 47.12,41.33 v1(42.28,36.49) ; v1(75.31,41.45) 75.3,41.46 67.45,41.46 v1(67.44,41.45) ; 76.71,81.84 v1(76.71,65.84)
  Bottom Layer w0.254: v1(50.8,41.33) 50.93,41.45 v1(67.44,41.45) ; v1(19.68,30.91) 25.25,36.49 v1(42.28,36.49) ; v1(75.31,41.45) 76.71,42.85 v1(76.71,65.84)
AO21: length 56.9
  Top Layer w0.254: 53.21,37.01 53.21,34.72 51.31,32.82 40.62,32.8 38.19,35.23 18.67,35.23 14.36,39.55 H14.1
AO22: length 64.3
  Top Layer w0.254: 55.75,37.01 55.63,36.88 v1(55.63,33.83) ; H14.6 18.82,35.59 38.34,35.59 40.09,33.83 v1(48.77,33.83)
  Bottom Layer w0.254: v1(48.77,33.83) v1(55.63,33.83)
BO11: length 60.4
  Top Layer w0.254: 96.65,29.39 88.51,37.53 v1(88.51,37.63) ; v1(83.05,63.03) 79.49,66.59 80.41,67.5 80.41,80.68 79.25,81.84
  Bottom Layer w0.254: v1(83.05,63.03) 83.05,43.09 v1(88.51,37.63)
BO12: length 49.6
  Top Layer w0.254: 96.65,42.09 99.44,44.88 99.44,66.47 96.65,69.27 94.36,69.27 81.79,81.84
BO21: length 43.6
  Top Layer w0.254: 58.29,37.01 59.69,35.61 77.34,35.61 88.65,46.91 H15.1
BO22: length 46.8
  Top Layer w0.254: H15.6 95.38,58.34 95.38,55.55 89.53,49.71 73.53,49.71 60.83,37.01
PA2: length 57.9
  Bottom Layer w0.254: U9.1 7.37,54.92 7.37,6.25 CN3.3
PA3: length 61.1
  Top Layer w0.254: v1(9.14,11.61) 9.14,10.08 3.81,4.75 CN3.4
  Bottom Layer w0.254: v1(9.14,11.61) 9.14,13.26 8.51,13.89 8.51,61.4 U9.38
PB7: length 1.5
  Bottom Layer w0.254: 28.75,99.14 27.71,98.1 U9.70
PB10: length 86.6
  Top Layer w0.254: v1(46.35,81.71) 46.23,81.58 v1(43.69,81.58)
  Bottom Layer w0.254: v1(46.35,81.71) 50.67,86.03 72.64,86.03 78.61,92 H16.2 ; U9.12 31.54,61.27 33.53,61.27 34.29,62.03 34.29,72.31 43.56,81.58 v1(43.69,81.58)
PB11: length 84.7
  Top Layer w0.254: v1(43.81,82.98) v1(46.35,82.98)
  Bottom Layer w0.254: H16.1 97.41,94.67 80.65,94.67 72.52,86.54 49.91,86.54 v1(46.35,82.98) ; U9.29 33.91,66.17 33.91,73.08 v1(43.81,82.98)
PC0: length 56.2
  Bottom Layer w0.254: 71.88,97.08 71.88,97.46 69.77,99.57 19.3,99.57 17.81,98.07 U9.74
PC1: length 54.3
  Top Layer w0.254: U9.48 24.28,91.34 v1(38,91.34)
  Bottom Layer w0.254: 69.34,97.08 68.3,98.12 63.14,98.12 56.24,91.22 38.12,91.22 v1(38,91.34)
PC2: length 59.4
  Top Layer w0.254: 76.96,97.08 75.67,95.79 65.68,95.79 62.12,99.34 21.36,99.34 U9.73
PC3: length 61.9
  Top Layer w0.254: v1(63.65,95.28) 77.7,95.28 79.5,97.08 ; U9.49 24.16,94.01 v1(33.04,94.01)
  Bottom Layer w0.254: v1(63.65,95.28) 58.59,90.22 36.83,90.22 v1(33.04,94.01)
PC4: length 44
  Top Layer w0.254: U9.5 23.01,49.43 v1(40.92,49.43)
  Bottom Layer w0.254: 50.93,52.25 48.11,49.43 v1(40.92,49.43)
PC5: length 42.1
  Top Layer w0.254: 48.39,52.25 48.26,52.25 46.1,50.09 22.86,50.09 16.26,56.69 16.26,61.27 U9.35
PC6: length 47.6
  Top Layer w0.254: U9.58 56.01,85.02 56.01,52.25
PC7: length 51.2
  Top Layer w0.254: U9.63 46.76,96.8 46.76,95.03 58.44,83.34 58.44,52.35 58.55,52.25
PD0: length 104.1
  Top Layer w0.254: U9.65 39.24,96.91 39.24,90.98 37.34,89.08 v1(28.7,89.08) ; H1.3 0.43,25.41 0.43,34.59 3.09,37.26 v1(12.45,37.26)
  Bottom Layer w0.254: v1(12.45,37.26) 16.26,41.07 16.26,81.46 23.88,89.08 v1(28.7,89.08)
PD1: length 98.5
  Top Layer w0.254: v1(45.34,84.25) 45.34,88.57 40.39,93.52 40.39,95.51 U9.56 ; v1(79.25,57.2) 72.01,57.2 v1(66.29,62.92) ; H2.3 v1(92.96,34.47)
  Bottom Layer w0.254: v1(79.25,57.2) 81.79,54.66 81.79,43.1 90.42,34.47 v1(92.96,34.47) ; v1(66.29,62.92) 64.79,64.42 54.63,64.42 45.34,73.71 v1(45.34,84.25)
PD2: length 54.5
  Top Layer w0.254: H14.3 0.43,46.36 0.43,88.57 U9.43
PD3: length 119.8
  Top Layer w0.254: v1(45.72,65.08) 35.31,65.08 8.51,91.87 8.51,96.06 7.87,96.7 3.47,96.7 U9.41 ; v1(92.96,51.87) 96.52,51.87 H15.3 ; v1(90.68,55.93) 90.55,56.06 v1(70.49,56.06) ; v1(50.29,65.08) v1(55.25,65.08)
  Bottom Layer w0.254: v1(45.72,65.08) v1(50.29,65.08) ; v1(90.68,55.93) 90.68,54.15 v1(92.96,51.87) ; v1(55.25,65.08) 66.29,65.08 70.49,60.88 v1(70.49,56.06)
PD4: length 108.6
  Top Layer w0.254: v1(27.94,93.14) 35.05,93.14 36.58,94.67 36.58,96.78 U9.66
  Bottom Layer w0.254: H1.4 6.86,32.18 6.86,53.95 0.78,60.03 0.78,88.32 5.61,93.14 v1(27.94,93.14)
PD5: length 108.4
  Top Layer w0.254: H2.4 v1(90.42,37.01) ; v1(46.61,74.6) 45.4,74.6 v1(34.45,85.55) ; v1(70.1,63.68) 79.12,63.68 v1(84.2,58.6) ; v1(33.4,92.13) 35.56,92.13 37.87,94.44 U9.55
  Bottom Layer w0.254: v1(84.2,58.6) 84.2,43.23 v1(90.42,37.01) ; v1(46.61,74.6) 51.56,69.65 62.23,69.65 68.2,63.68 v1(70.1,63.68) ; v1(33.4,92.13) 31.5,92.13 30.73,91.36 30.73,89.33 34.45,85.62 v1(34.45,85.55)
PD6: length 81.9
  Bottom Layer w0.254: H14.4 0.43,48.9 0.43,88.7 5.76,94.03 28.32,94.03 29.08,94.79 29.08,96.19 29.72,96.83 34.08,96.83 U9.67
PD7: length 95.2
  Top Layer w0.254: H15.4 98.81,56.69 98.81,65.33 97.66,66.47 v1(90.93,66.47) ; v1(43.81,92) 47.12,88.7 v1(47.12,80.57)
  Bottom Layer w0.254: U9.54 38.87,92 v1(43.81,92) ; v1(90.93,66.47) 87,66.47 74.17,79.3 68.45,79.3 65.66,76.5 50.42,76.5 47.12,79.81 v1(47.12,80.57)
PE9: length 63
  Bottom Layer w0.254: 66.8,97.08 59.06,89.33 47.88,89.33 21.34,62.79 21.34,61.22 U9.8
PE11: length 76.4
  Bottom Layer w0.254: U9.9 23.88,61.22 23.88,64.06 46.86,87.04 72,87.04 82.04,97.08
PE13: length 23.9
  Top Layer w0.254: 45.85,52.25 32.9,52.25 25.17,59.97
PE14: length 42.1
  Top Layer w0.254: U9.30 29.76,64.57 40.64,64.57 41.78,63.42 41.78,58.72 46.63,53.88 v1(51.97,53.88)
  Bottom Layer w0.254: v1(51.97,53.88) 59.46,53.88 61.09,52.25
$1N2072: length 89.5
  Top Layer w0.8: v1(36.32,11.74) 43.56,4.5 44.2,4.5 47.12,7.42 60.96,7.42 v1(72.52,18.97)
  Bottom Layer w0.8: v1(72.52,18.97) 78.23,24.69 85.34,24.69 93.47,16.56 H6.1 H6.2 98.38,17.28 98.38,22.28 ; v1(36.32,11.74) 28.94,11.74 DC1.1

## Copper pours and planes (outline as drawn; the poured copper is in the pictures)
GND on Top Layer: -14.99,114.6 105.03,114.6 105.03,-11.38 -14.99,-11.38
GND on Bottom Layer: -17.78,112.32 105.03,112.32 105.03,-10.87 -17.78,-10.87

Small or netless copper shapes (teardrops, artwork), in the pictures only: 125 on Top Layer, 120 on Bottom Layer

## Text on the board
Top Silkscreen Layer: RX | VCC | GND | TX | 12V | 5V | Rx | Tx
